# Altium schematic sheet Test32U2.SchDoc
size A4
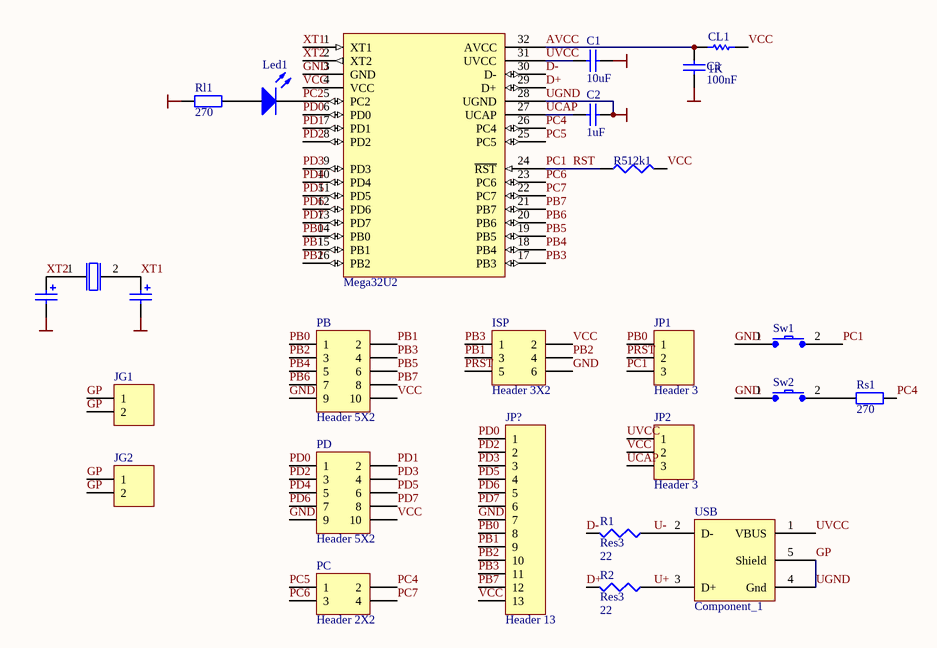
[diagram p0: Test32U2.SchDoc]

## Parts
?  Mega32U2  [ATMega32U2]
C1  value 10uF  [CC3216-1206]
C2  value 1uF  [CC3216-1206]
C3  value 100nF  [CC1608-0603]
CL1  value 1K  [AXIAL-0.3]  (hidden comment: Res1)
Cx1  Cap Pol3  [CC2012-0805]  (value not drawn)
Cx2  Cap Pol3  [CC2012-0805]  (value not drawn)
ISP  Header 3X2  [HDR2X3]
JG1  Header 2  [HDR1X2]  (value not drawn)
JG2  Header 2  [HDR1X2]  (value not drawn)
JP1  Header 3  [HDR1X3]
JP2  Header 3  [HDR1X3]
JP?  Header 13  [HDR1X13]
Led1  (no value)  [CC1608-0603]
PB  Header 5X2  [HDR2X5]
PC  Header 2X2  [HDR2X2]
PD  Header 5X2  [HDR2X5]
R1  Res3  value 22  [C1608-0603]
R2  Res3  value 22  [C1608-0603]
R5  value 12k1  [C1608-0603]
Rl1  value 270  [CR2012-0805]  (hidden comment: Res Semi)
Rs1  value 270  [CR2012-0805]  (hidden comment: Res Semi)
Sw1  Component_1  [MTS-1132]  (value not drawn)
Sw2  Component_1  [MTS-1132]  (value not drawn)
USB  Component_1  [USBB]
Xc1  Component_1  [HC49]  (value not drawn)

## Nets
GND: ?.3(GND) ?.28(UGND) C1.2 C2.2 C3.1 Cx1.2 Cx2.2 ISP.6 JG1.1 JG1.2 JG2.1 JG2.2 JP?.7 PB.9 PD.9 Sw1.1 Sw2.1 USB.4(Gnd) USB.5(Shield)  [also labelled GP, UGND]
VCC: ?.4(VCC) CL1.2 ISP.2 JP2.2 JP?.13 PB.10 PD.10 R5.2 Rl1.2
AVCC: ?.32(AVCC) C3.2 CL1.1
D+: ?.29(D+) R2.2
D-: ?.30(D-) R1.2
PB0: ?.14(PB0) JP1.1 JP?.8 PB.1
PB1: ?.15(PB1) ISP.3 JP?.9 PB.2
PB2: ?.16(PB2) ISP.4 JP?.10 PB.3
PB3: ?.17(PB3) ISP.1 JP?.11 PB.4
PB4: ?.18(PB4) PB.5
PB5: ?.19(PB5) PB.6
PB6: ?.20(PB6) PB.7
PB7: ?.21(PB7) JP?.12 PB.8
PC1: ?.24(~{RST}) JP1.3 R5.1 Sw1.2  [also labelled RST]
PC2: ?.5(PC2) Led1.2(K)
PC4: ?.26(PC4) PC.2 Rs1.1
PC5: ?.25(PC5) PC.1
PC6: ?.23(PC6) PC.3
PC7: ?.22(PC7) PC.4
PD0: ?.6(PD0) JP?.1 PD.1
PD1: ?.7(PD1) PD.2
PD2: ?.8(PD2) JP?.2 PD.3
PD3: ?.9(PD3) JP?.3 PD.4
PD4: ?.10(PD4) PD.5
PD5: ?.11(PD5) JP?.4 PD.6
PD6: ?.12(PD6) JP?.5 PD.7
PD7: ?.13(PD7) JP?.6 PD.8
PRST: ISP.5 JP1.2
U+: R2.1 USB.3(D+)
U-: R1.1 USB.2(D-)
UCAP: ?.27(UCAP) C2.1 JP2.3
UVCC: ?.31(UVCC) C1.1 JP2.1 USB.1(VBUS)
XT1: ?.1(XT1) Cx1.1 Xc1.2
XT2: ?.2(XT2) Cx2.1 Xc1.1
NetLed1_1: Led1.1(A) Rl1.1
NetRs1_2: Rs1.2 Sw2.2

## Library data of the parts
? = Component_1
C1-C3 = Cap Semi: Capacitor (Semiconductor SIM Model); Published: 8-Jun-2000; Revision: July-2002: Re-released for DXP Platform.; Publisher: Altium Limited
CL1 = Res1: Resistor; Published: 8-Jun-2000; Revision: July-2002: Re-released for DXP Platform.; Publisher: Altium Limited
Cx1 Cx2 = Cap Pol3: Polarized Capacitor (Surface Mount); Value: 18pF; Published: 8-Jun-2000; Revision: July-2002: Re-released for DXP Platform.; Publisher: Altium Limited
ISP = Header 3X2: Header, 3-Pin, Dual row; Revision: 17-Jul-2002: Re-released for DXP Platform.; Publisher: Altium Limited
JG1 JG2 = Header 2: Header, 2-Pin; Revision: 17-Jul-2002: Re-released for DXP Platform.; Publisher: Altium Limited
JP1 JP2 = Header 3: Header, 3-Pin; Revision: 17-Jul-2002: Re-released for DXP Platform.; Publisher: Altium Limited
JP? = Header 13: Header, 13-Pin; Revision: 17-Jul-2002: Re-released for DXP Platform.; Publisher: Altium Limited
Led1 = LED3: Typical BLUE SiC LED; Revision 1: Jul-2002: Re-released for DXP Platform.; Revision 2: 17-Dec-2003: PCB Footprint replaced.; Published: 8-Jun-2000; Publisher: Altium Limited
PB PD = Header 5X2: Header, 5-Pin, Dual row; Revision: 17-Jul-2002: Re-released for DXP Platform.; Publisher: Altium Limited
PC = Header 2X2: Header, 2-Pin, Dual row; Revision: 17-Jul-2002: Re-released for DXP Platform.; Publisher: Altium Limited
R1 R2 R5 = Res3: Resistor; Published: 8-Jun-2000; Revision: July-2002: Re-released for DXP Platform.; Publisher: Altium Limited
Rl1 Rs1 = Res Semi: Semiconductor Resistor; Published: 8-Jun-2000; Revision: July-2002: Re-released for DXP Platform.; Publisher: Altium Limited